# Altium project SSDI.PrjPCB
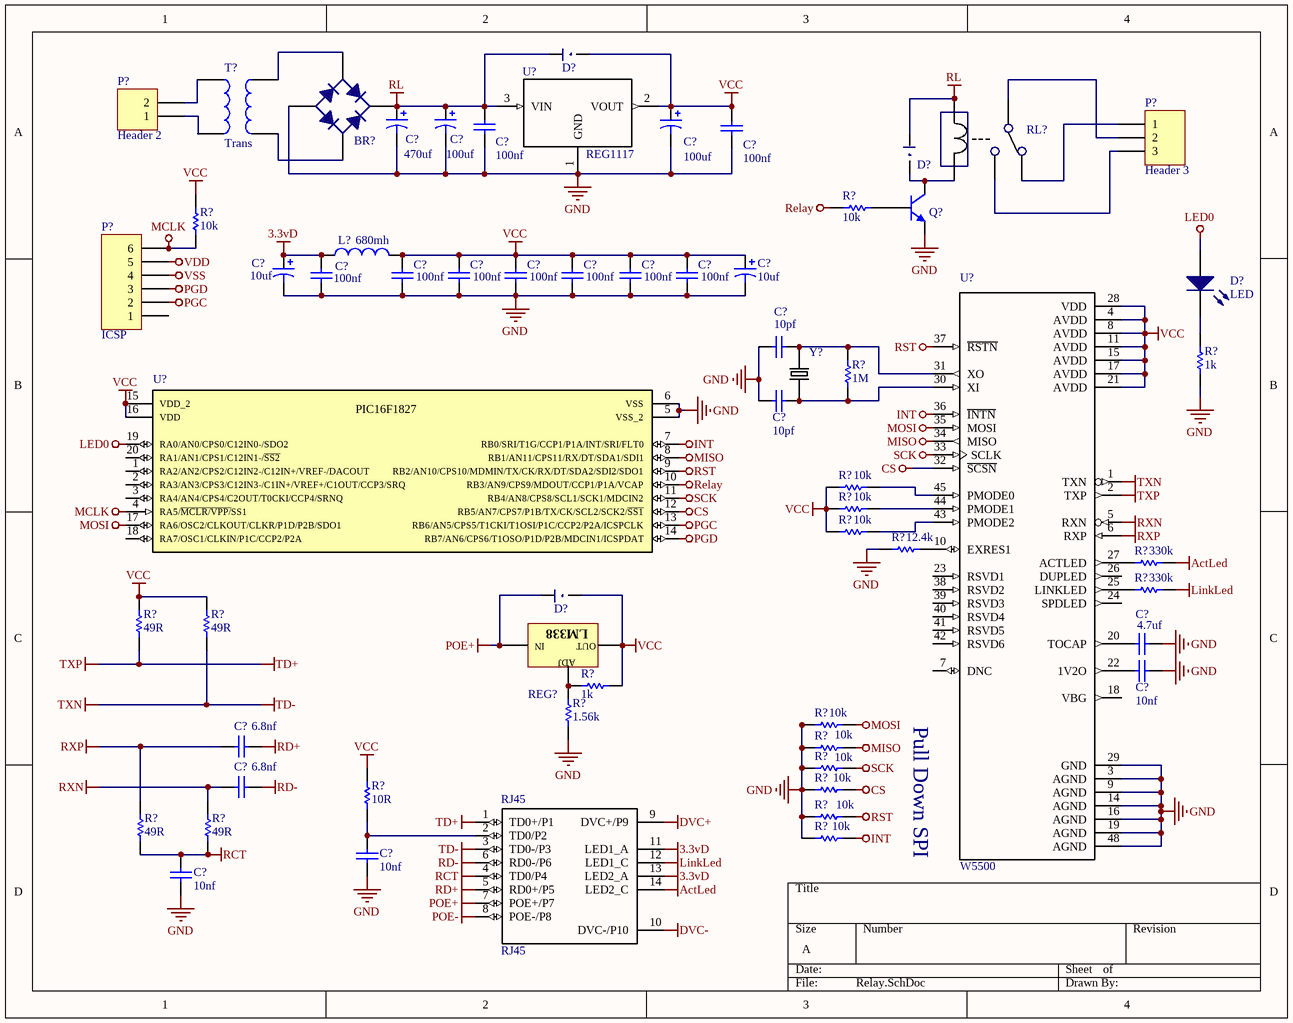
[diagram p0: Relay.SchDoc]
4 sheets, 235 parts. Net scope: global (net labels, ports and power ports of the same name join across sheets).
Sheets:
  Relay.SchDoc
  Switch.SchDoc
  Keypad.SchDoc
  Motor_SBS.SchDoc

## Sheet Relay.SchDoc
size A

### Parts
(Parts that share a designator on the sheet are numbered #1, #2 ... from top to bottom, then left to right.)
BR?#1  Puente Diodo Rectificador  [Bridge Rectifier 1]  (value not drawn)
C?#1  470uf  [Electrolytic Capacitor 1000uF 50V]
C?#2  100uf  [Electrolytic Capacitor 100uf-220uf 50V]
C?#3  100nf  [1206CAP]
C?#4  100uf  [Electrolytic Capacitor S]
C?#5  100nf  [1206CAP]
C?#6  10uf  [Electrolytic Capacitor S]
C?#7  100nf  [1206CAP]
C?#8  100nf  [1206CAP]
C?#9  100nf  [1206CAP]
C?#10  100nf  [1206CAP]
C?#11  100nf  [1206CAP]
C?#12  100nf  [1206CAP]
C?#13  100nf  [1206CAP]
C?#14  10uf  [Electrolytic Capacitor S]
C?#15  10pf  [1206CAP]
C?#16  10pf  [1206CAP]
C?#17  4.7uf  [1206CAP]
C?#18  10nf  [1206CAP]
C?#19  6.8nf  [1206CAP]
C?#20  6.8nf  [1206CAP]
C?#21  10nf  [1206CAP]
C?#22  10nf  [1206CAP]
D?#1  Diodo  [1206DIODE]  (value not drawn)
D?#2  Diodo  [1206DIODE]  (value not drawn)
D?#3  LED  [1206DIODE]
D?#4  Diodo  [1206DIODE]  (value not drawn)
L?#1  value 680mh  [Resistor 1/2 W]  (hidden comment: Inductor)
P?#1  Header 3  [HDR1X3]
P?#2  Header 2  [HDR1X2]
P?#3  ICSP  [HDR1X6]
Q?  Transistor NPN  [SOT-232N3904NPN]  (value not drawn)
R?#1  10k  [1206RES]
R?#2  10k  [1206RES]
R?#3  1k  [1206RES]
R?#4  1M  [1206RES]
R?#5  10k  [1206RES]
R?#6  10k  [1206RES]
R?#7  10k  [1206RES]
R?#8  12.4k  [1206RES]
R?#9  330k  [1206RES]
R?#10  330k  [1206RES]
R?#11  49R  [1206RES]
R?#12  49R  [1206RES]
R?#13  1k  [1206RES]
R?#14  1.56k  [1206RES]
R?#15  10k  [1206RES]
R?#16  10k  [1206RES]
R?#17  10k  [1206RES]
R?#18  10k  [1206RES]
R?#19  10R  [1206RES]
R?#20  10k  [1206RES]
R?#21  49R  [1206RES]
R?#22  49R  [1206RES]
R?#23  10k  [1206RES]
REG?#1  LM338  [TO-220]  (value not drawn)
RJ45#1  RJ45  [RJ45]
RL?  Relay SPDT  [SPDT Relay]  (value not drawn)
T?#1  Trans  [TRANS]
U?#1  REG1117  [SOT223]
U?#2  W5500  [QFP50P900X900X160-48N]
U?#3  PIC16F1827-I/SS  [SSOP-20]  (value not drawn)
Y?#1  E  [XTAL]  (value not drawn)

### Nets
3.3vD: C?#6.1 C?#7.2 L?#1.1 RJ45#1.11(LED1_A) RJ45#1.13(LED2_A)
ActLed: R?#9.2 RJ45#1.14(LED2_C)
CS: R?#18.2 U?#2.32(~{SCSN}) U?#3.12(RB5/AN7/CPS7/P1B/TX/CK/SCL2/SCK2/~{SS1})
DVC+: RJ45#1.9(DVC+/P9)
DVC-: RJ45#1.10(DVC-/P10)
GND: BR?#1.3(A) C?#1.2 C?#2.2 C?#3.1 C?#4.2 C?#5.1 C?#6.2 C?#7.1 C?#8.1 C?#9.1 C?#10.1 C?#11.1 C?#12.1 C?#13.1 C?#14.2 C?#15.1 C?#16.1 C?#17.2 C?#18.2 C?#21.2 C?#22.2 Q?.1(E) R?#3.2 R?#8.1 R?#14.1 R?#15.1 R?#16.1 R?#17.1 R?#18.1 R?#20.1 R?#23.1 U?#1.1(GND) U?#2.3(AGND) U?#2.9(AGND) U?#2.14(AGND) U?#2.16(AGND) U?#2.19(AGND) U?#2.29(GND) U?#2.48(AGND) U?#3.5(VSS_2) U?#3.6(VSS)
INT: R?#23.2 U?#2.36(~{INTN}) U?#3.7(RB0/SRI/T1G/CCP1/P1A/INT/SRI/FLT0)
LED0: D?#3.1(A) U?#3.19(RA0/AN0/CPS0/C12IN0-/SDO2)
LinkLed: R?#10.2 RJ45#1.12(LED1_C)
MCLK: P?#3.6 R?#2.1 U?#3.4(RA5/~{MCLR/VPP/}SS1)
MISO: R?#16.2 U?#2.34(MISO) U?#3.8(RB1/AN11/CPS11/RX/DT/SDA1/SDI1)
MOSI: R?#15.2 U?#2.35(MOSI) U?#3.17(RA6/OSC2/CLKOUT/CLKR/P1D/P2B/SDO1)
PGC: P?#3.2 U?#3.13(RB6/AN5/CPS5/T1CKI/T1OSI/P1C/CCP2/P2A/ICSPCLK)
PGD: P?#3.3 U?#3.14(RB7/AN6/CPS6/T1OSO/P1D/P2B/MDCIN1/ICSPDAT)
POE+: D?#4.2 REG?#1.3 RJ45#1.7(POE+/P7)
POE-: RJ45#1.8(POE-/P8)
RCT: C?#22.1 R?#21.2 R?#22.2 RJ45#1.4(TD0/P4)
RD+: C?#19.1 RJ45#1.5(RD0+/P5)
RD-: C?#20.1 RJ45#1.6(RD0-/P6)
Relay: R?#1.2 U?#3.10(RB3/AN9/CPS9/MDOUT/CCP1/P1A/VCAP)
RL: BR?#1.1(K) C?#1.1 C?#2.1 C?#3.2 D?#1.2 D?#2.2 RL?.1 U?#1.3(VIN)
RST: R?#20.2 U?#2.37(~{RSTN}) U?#3.9(RB2/AN10/CPS10/MDMIN/TX/CK/RX/DT/SDA2/SDI2/SDO1)
RXN: C?#20.2 R?#22.1 U?#2.5(RXN)
RXP: C?#19.2 R?#21.1 U?#2.6(RXP)
SCK: R?#17.2 U?#2.33(SCLK) U?#3.11(RB4/AN8/CPS8/SCL1/SCK1/MDCIN2)
TD+: R?#11.2 RJ45#1.1(TD0+/P1) U?#2.2(TXP)  [also labelled TXP]
TD-: R?#12.2 RJ45#1.3(TD0-/P3) U?#2.1(TXN)  [also labelled TXN]
VCC: C?#4.1 C?#5.2 C?#8.2 C?#9.2 C?#10.2 C?#11.2 C?#12.2 C?#13.2 C?#14.1 D?#1.1 D?#4.1 L?#1.2 R?#2.2 R?#5.1 R?#6.1 R?#7.1 R?#11.1 R?#12.1 R?#13.2 R?#19.1 REG?#1.2 U?#1.2(VOUT) U?#2.4(AVDD) U?#2.8(AVDD) U?#2.11(AVDD) U?#2.15(AVDD) U?#2.17(AVDD) U?#2.21(AVDD) U?#2.28(VDD) U?#3.15(VDD_2) U?#3.16(VDD)
VDD: P?#3.5
VSS: P?#3.4
NetBR?#1_2: BR?#1.2(C) T?#1.3
NetBR?#1_4: BR?#1.4(C) T?#1.4
NetC?#15_2: C?#15.2 R?#4.2 U?#2.31(XO) Y?#1.1
NetC?#16_2: C?#16.2 R?#4.1 U?#2.30(XI) Y?#1.2
NetC?#17_1: C?#17.1 U?#2.20(TOCAP)
NetC?#18_1: C?#18.1 U?#2.22(1V2O)
NetC?#21_1: C?#21.1 R?#19.2 RJ45#1.2(TD0/P2)
NetD?#2_1: D?#2.1 Q?.3(C) RL?.2
NetD?#3_2: D?#3.2(K) R?#3.1
NetP?#1_1: P?#1.1 RL?.5
NetP?#1_2: P?#1.2 RL?.3
NetP?#1_3: P?#1.3 RL?.4
NetP?#2_1: P?#2.1 T?#1.2
NetP?#2_2: P?#2.2 T?#1.1
NetQ?_2: Q?.2(B) R?#1.1
NetR?#5_2: R?#5.2 U?#2.45(PMODE0)
NetR?#6_2: R?#6.2 U?#2.44(PMODE1)
NetR?#7_2: R?#7.2 U?#2.43(PMODE2)
NetR?#8_2: R?#8.2 U?#2.10(EXRES1)
NetR?#9_1: R?#9.1 U?#2.27(ACTLED)
NetR?#10_1: R?#10.1 U?#2.25(LINKLED)
NetR?#13_1: R?#13.1 R?#14.2 REG?#1.1

Not connected (* = marked no-connect by the designer): P?#3 1; U?#2 7(DNC) 18(VBG) 23(RSVD1) 24(SPDLED) 26(DUPLED) 38(RSVD2) 39(RSVD3) 40(RSVD4) 41(RSVD5) 42(RSVD6); U?#3 1(RA2/AN2/CPS2/C12IN2-/C12IN+/VREF-/DACOUT) 2(RA3/AN3/CPS3/C12IN3-/C1IN+/VREF+/C1OUT/CCP3/SRQ) 3(RA4/AN4/CPS4/C2OUT/T0CKI/CCP4/SRNQ) 18(RA7/OSC1/CLKIN/P1C/CCP2/P2A) 20(RA1/AN1/CPS1/C12IN1-/~{SS2})

### Notes on the sheet
- (near U?#2) Pull Down SPI
- (in symbol LM338) IN; OUT; ADJ
- (in symbol PIC16F1827-I/SS) PIC16F1827

### Library data of the parts
C?#1 C?#2 C?#4 C?#6 C?#14 = Capacitor Electrolitico
C?#3 C?#5 C?#7-C?#13 C?#15-C?#22 = Capacitor de paso
D?#3 = LED: Typical LED; Published: 8-Jun-2000; LatestRevisionDate: 17-Jul-2002; LatestRevisionNote: Re-released for DXP Platform.; PackageVersion: Feb-2002; PackageReference: 3.2X1.6X1.1; Publisher: Altium Limited
L?#1 = Inductor: Code_IEC: 1005; Published: 8-Jun-2000; LatestRevisionDate: 29-May-2009; LatestRevisionNote: IPC-7351 Footprint Added.; PackageReference: 0402-A; Publisher: Altium Limited; PackageDescription: Chip Inductor; Code_JEITA: 0402
P?#1 = Header 3: Header, 3-Pin; LatestRevisionDate: 17-Jul-2002; LatestRevisionNote: Re-released for DXP Platform.; Publisher: Altium Limited
P?#2 = Header 2: Header, 2-Pin; LatestRevisionDate: 17-Jul-2002; LatestRevisionNote: Re-released for DXP Platform.; Publisher: Altium Limited
P?#3 = Header 6: Header, 6-Pin; LatestRevisionDate: 17-Jul-2002; LatestRevisionNote: Re-released for DXP Platform.; Publisher: Altium Limited
R?#1-R?#23 = Resistor
REG?#1 = LM338: Variable Voltage Regulator
RJ45#1 = RJ45Poe
T?#1 = Trans: Transformer; Published: 24-Mar-1999; LatestRevisionDate: 08-Jul-2005; LatestRevisionNote: Mech Layer 1 removed.; PackageReference: TRANS; Publisher: Altium Limited; PackageDescription: Transformer; 4 Leads
U?#1 = REG1117: LDO Regulator Pos 1.25V to 13.5V 0.8A 4-Pin_3+Tab_ SOT-223 Tube; MF: Texas Instruments; Digi-Key_Purchase_URL: https://www.digikey.com/product-detail/en/texas-instruments/REG1117/REG1117-ND/251211?utm_source=snapeda&utm_medium=aggregator&utm_campaign=symbol; MP: REG1117; Package: SOT-223-4 Texas Instruments; Digi-Key_Part_Number: REG1117-ND; SnapEDA_Link: https://www.snapeda.com/parts/REG1117/Texas%20Instruments/view-part/?ref=snap; Value: *
U?#2 = W5500: Victor Pure White Collection Wood Tidy Tower Organizer; MF: WIZnet; Package: LQFP-48 Victor Technologies; Price: None; Availability: Unavailable; MP: W5500; SnapEDA_Link: https://www.snapeda.com/parts/W5500/WIZnet/view-part/?ref=snap; Value: *
U?#3 = PIC16F1827-I/SS: PIC12 Series 384 B RAM 7 kB Flash 80 MHz 8-Bit Microcontroller SMT - SSOP-20; MF: Microchip; MP: PIC16F1827-I/SS; Digi-Key_Purchase_URL: https://www.digikey.do/product-detail/en/microchip-technology/PIC16F1827-I-SS/PIC16F1827-I-SS-ND/2201967?utm_source=snapeda&utm_medium=aggregator&utm_campaign=symbol; Package: SSOP-20 Microchip; SnapEDA_Link: https://www.snapeda.com/parts/PIC16F1827-I/SS/Microchip/view-part/?ref=snap; Digi-Key_Part_Number: PIC16F1827-I/SS-ND; Value: *
Y?#1 = ECS-160-20-20A-TR: Semi-Frequency Controls-Surface Mount Crystals; MF: ECS Inc.; MP: ECS-160-20-20A-TR; Package: SMD-2 ECS International; Availability: Unavailable; Price: None; SnapEDA_Link: https://www.snapeda.com/parts/ECS-160-20-20A-TR/ECS%20Inc./view-part/?ref=snap; Value: *

## Sheet Switch.SchDoc
size A
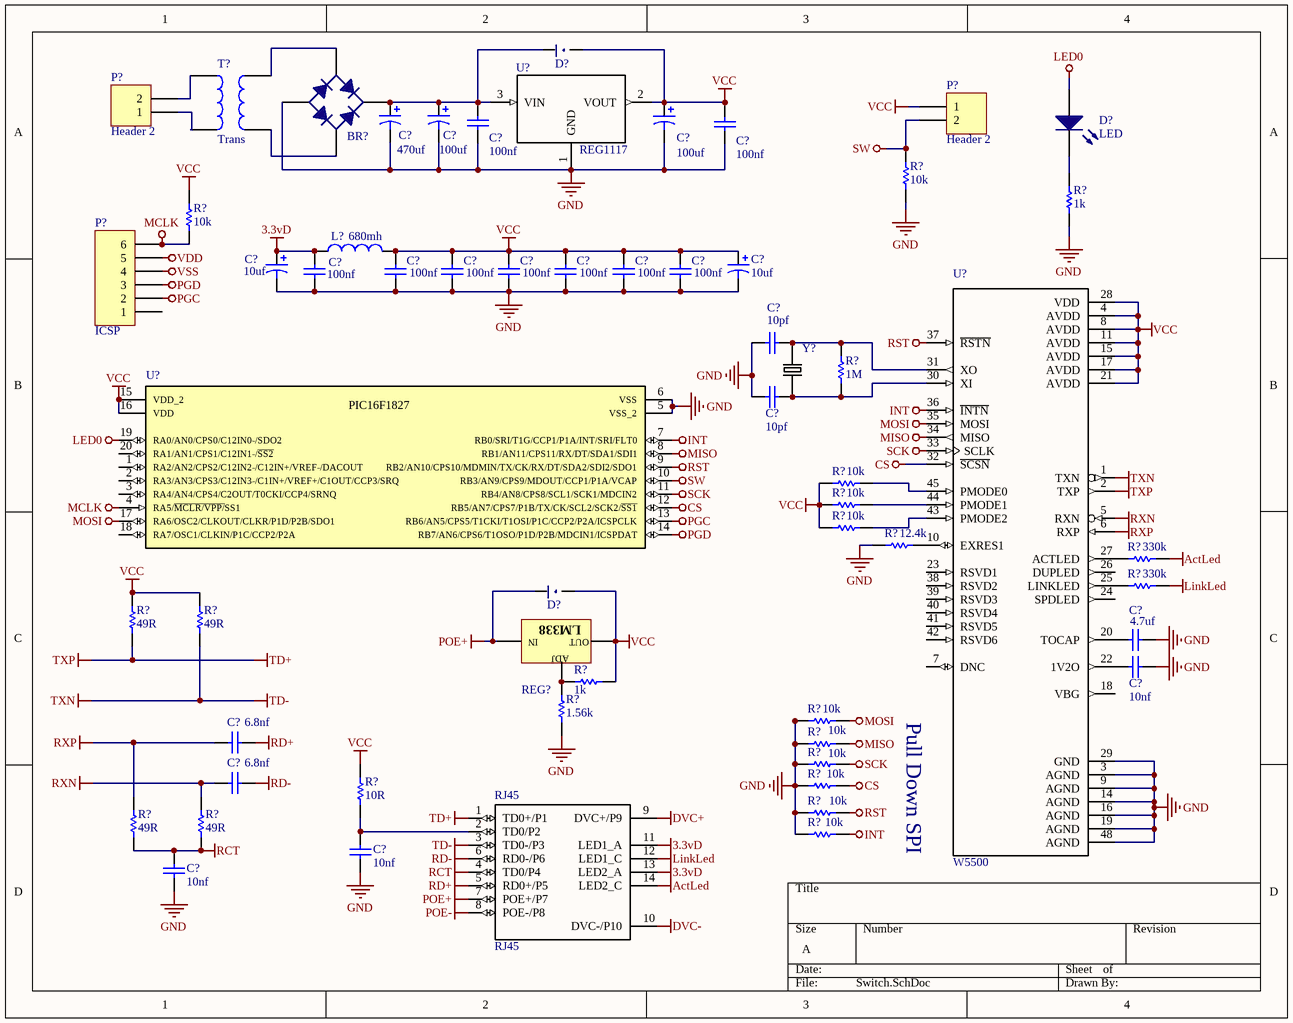
[diagram p1: Switch.SchDoc]

### Parts
(Parts that share a designator on the sheet are numbered #1, #2 ... from top to bottom, then left to right.)
BR?#2  Puente Diodo Rectificador  [Bridge Rectifier 1]  (value not drawn)
C?#23  470uf  [Electrolytic Capacitor 1000uF 50V]
C?#24  100uf  [Electrolytic Capacitor 100uf-220uf 50V]
C?#25  100nf  [1206CAP]
C?#26  100uf  [Electrolytic Capacitor S]
C?#27  100nf  [1206CAP]
C?#28  10uf  [Electrolytic Capacitor S]
C?#29  100nf  [1206CAP]
C?#30  100nf  [1206CAP]
C?#31  100nf  [1206CAP]
C?#32  100nf  [1206CAP]
C?#33  100nf  [1206CAP]
C?#34  100nf  [1206CAP]
C?#35  100nf  [1206CAP]
C?#36  10uf  [Electrolytic Capacitor S]
C?#37  10pf  [1206CAP]
C?#38  10pf  [1206CAP]
C?#39  4.7uf  [1206CAP]
C?#40  10nf  [1206CAP]
C?#41  6.8nf  [1206CAP]
C?#42  6.8nf  [1206CAP]
C?#43  10nf  [1206CAP]
C?#44  10nf  [1206CAP]
D?#5  Diodo  [1206DIODE]  (value not drawn)
D?#6  LED  [1206DIODE]
D?#7  Diodo  [1206DIODE]  (value not drawn)
L?#2  value 680mh  [Resistor 1/2 W]  (hidden comment: Inductor)
P?#4  Header 2  [HDR1X2]
P?#5  Header 2  [HDR1X2]
P?#6  ICSP  [HDR1X6]
R?#24  10k  [1206RES]
R?#25  1k  [1206RES]
R?#26  10k  [1206RES]
R?#27  1M  [1206RES]
R?#28  10k  [1206RES]
R?#29  10k  [1206RES]
R?#30  10k  [1206RES]
R?#31  12.4k  [1206RES]
R?#32  330k  [1206RES]
R?#33  330k  [1206RES]
R?#34  49R  [1206RES]
R?#35  49R  [1206RES]
R?#36  1k  [1206RES]
R?#37  1.56k  [1206RES]
R?#38  10k  [1206RES]
R?#39  10k  [1206RES]
R?#40  10k  [1206RES]
R?#41  10R  [1206RES]
R?#42  10k  [1206RES]
R?#43  10k  [1206RES]
R?#44  49R  [1206RES]
R?#45  49R  [1206RES]
R?#46  10k  [1206RES]
REG?#2  LM338  [TO-220]  (value not drawn)
RJ45#2  RJ45  [RJ45]
T?#2  Trans  [TRANS]
U?#4  REG1117  [SOT223]
U?#5  W5500  [QFP50P900X900X160-48N]
U?#6  PIC16F1827-I/SS  [SSOP-20]  (value not drawn)
Y?#2  E  [XTAL]  (value not drawn)

### Nets
3.3vD: C?#28.1 C?#29.2 L?#2.1 RJ45#2.11(LED1_A) RJ45#2.13(LED2_A)
ActLed: R?#32.2 RJ45#2.14(LED2_C)
CS: R?#42.2 U?#5.32(~{SCSN}) U?#6.12(RB5/AN7/CPS7/P1B/TX/CK/SCL2/SCK2/~{SS1})
DVC+: RJ45#2.9(DVC+/P9)
DVC-: RJ45#2.10(DVC-/P10)
GND: BR?#2.3(A) C?#23.2 C?#24.2 C?#25.1 C?#26.2 C?#27.1 C?#28.2 C?#29.1 C?#30.1 C?#31.1 C?#32.1 C?#33.1 C?#34.1 C?#35.1 C?#36.2 C?#37.1 C?#38.1 C?#39.2 C?#40.2 C?#43.2 C?#44.2 R?#24.2 R?#25.2 R?#31.1 R?#37.1 R?#38.1 R?#39.1 R?#40.1 R?#42.1 R?#43.1 R?#46.1 U?#4.1(GND) U?#5.3(AGND) U?#5.9(AGND) U?#5.14(AGND) U?#5.16(AGND) U?#5.19(AGND) U?#5.29(GND) U?#5.48(AGND) U?#6.5(VSS_2) U?#6.6(VSS)
INT: R?#46.2 U?#5.36(~{INTN}) U?#6.7(RB0/SRI/T1G/CCP1/P1A/INT/SRI/FLT0)
LED0: D?#6.1(A) U?#6.19(RA0/AN0/CPS0/C12IN0-/SDO2)
LinkLed: R?#33.2 RJ45#2.12(LED1_C)
MCLK: P?#6.6 R?#26.1 U?#6.4(RA5/~{MCLR/VPP/}SS1)
MISO: R?#39.2 U?#5.34(MISO) U?#6.8(RB1/AN11/CPS11/RX/DT/SDA1/SDI1)
MOSI: R?#38.2 U?#5.35(MOSI) U?#6.17(RA6/OSC2/CLKOUT/CLKR/P1D/P2B/SDO1)
PGC: P?#6.2 U?#6.13(RB6/AN5/CPS5/T1CKI/T1OSI/P1C/CCP2/P2A/ICSPCLK)
PGD: P?#6.3 U?#6.14(RB7/AN6/CPS6/T1OSO/P1D/P2B/MDCIN1/ICSPDAT)
POE+: D?#7.2 REG?#2.3 RJ45#2.7(POE+/P7)
POE-: RJ45#2.8(POE-/P8)
RCT: C?#44.1 R?#44.2 R?#45.2 RJ45#2.4(TD0/P4)
RD+: C?#41.1 RJ45#2.5(RD0+/P5)
RD-: C?#42.1 RJ45#2.6(RD0-/P6)
RST: R?#43.2 U?#5.37(~{RSTN}) U?#6.9(RB2/AN10/CPS10/MDMIN/TX/CK/RX/DT/SDA2/SDI2/SDO1)
RXN: C?#42.2 R?#45.1 U?#5.5(RXN)
RXP: C?#41.2 R?#44.1 U?#5.6(RXP)
SCK: R?#40.2 U?#5.33(SCLK) U?#6.11(RB4/AN8/CPS8/SCL1/SCK1/MDCIN2)
SW: P?#4.2 R?#24.1 U?#6.10(RB3/AN9/CPS9/MDOUT/CCP1/P1A/VCAP)
TD+: R?#34.2 RJ45#2.1(TD0+/P1) U?#5.2(TXP)  [also labelled TXP]
TD-: R?#35.2 RJ45#2.3(TD0-/P3) U?#5.1(TXN)  [also labelled TXN]
VCC: C?#26.1 C?#27.2 C?#30.2 C?#31.2 C?#32.2 C?#33.2 C?#34.2 C?#35.2 C?#36.1 D?#5.1 D?#7.1 L?#2.2 P?#4.1 R?#26.2 R?#28.1 R?#29.1 R?#30.1 R?#34.1 R?#35.1 R?#36.2 R?#41.1 REG?#2.2 U?#4.2(VOUT) U?#5.4(AVDD) U?#5.8(AVDD) U?#5.11(AVDD) U?#5.15(AVDD) U?#5.17(AVDD) U?#5.21(AVDD) U?#5.28(VDD) U?#6.15(VDD_2) U?#6.16(VDD)
VDD: P?#6.5
VSS: P?#6.4
NetBR?#2_1: BR?#2.1(K) C?#23.1 C?#24.1 C?#25.2 D?#5.2 U?#4.3(VIN)
NetBR?#2_2: BR?#2.2(C) T?#2.3
NetBR?#2_4: BR?#2.4(C) T?#2.4
NetC?#37_2: C?#37.2 R?#27.2 U?#5.31(XO) Y?#2.1
NetC?#38_2: C?#38.2 R?#27.1 U?#5.30(XI) Y?#2.2
NetC?#39_1: C?#39.1 U?#5.20(TOCAP)
NetC?#40_1: C?#40.1 U?#5.22(1V2O)
NetC?#43_1: C?#43.1 R?#41.2 RJ45#2.2(TD0/P2)
NetD?#6_2: D?#6.2(K) R?#25.1
NetP?#5_1: P?#5.1 T?#2.2
NetP?#5_2: P?#5.2 T?#2.1
NetR?#28_2: R?#28.2 U?#5.45(PMODE0)
NetR?#29_2: R?#29.2 U?#5.44(PMODE1)
NetR?#30_2: R?#30.2 U?#5.43(PMODE2)
NetR?#31_2: R?#31.2 U?#5.10(EXRES1)
NetR?#32_1: R?#32.1 U?#5.27(ACTLED)
NetR?#33_1: R?#33.1 U?#5.25(LINKLED)
NetR?#36_1: R?#36.1 R?#37.2 REG?#2.1

Not connected (* = marked no-connect by the designer): P?#6 1; U?#5 7(DNC) 18(VBG) 23(RSVD1) 24(SPDLED) 26(DUPLED) 38(RSVD2) 39(RSVD3) 40(RSVD4) 41(RSVD5) 42(RSVD6); U?#6 1(RA2/AN2/CPS2/C12IN2-/C12IN+/VREF-/DACOUT) 2(RA3/AN3/CPS3/C12IN3-/C1IN+/VREF+/C1OUT/CCP3/SRQ) 3(RA4/AN4/CPS4/C2OUT/T0CKI/CCP4/SRNQ) 18(RA7/OSC1/CLKIN/P1C/CCP2/P2A) 20(RA1/AN1/CPS1/C12IN1-/~{SS2})

### Notes on the sheet
- (near U?#5) Pull Down SPI
- (in symbol LM338) IN; OUT; ADJ
- (in symbol PIC16F1827-I/SS) PIC16F1827

### Library data of the parts
C?#23 C?#24 C?#26 C?#28 C?#36 = Capacitor Electrolitico
C?#25 C?#27 C?#29-C?#35 C?#37-C?#44 = Capacitor de paso
D?#6 = LED: Typical LED; Published: 8-Jun-2000; LatestRevisionDate: 17-Jul-2002; LatestRevisionNote: Re-released for DXP Platform.; PackageVersion: Feb-2002; PackageReference: 3.2X1.6X1.1; Publisher: Altium Limited
L?#2 = Inductor: Code_IEC: 1005; Published: 8-Jun-2000; LatestRevisionDate: 29-May-2009; LatestRevisionNote: IPC-7351 Footprint Added.; PackageReference: 0402-A; Publisher: Altium Limited; PackageDescription: Chip Inductor; Code_JEITA: 0402
P?#4 P?#5 = Header 2: Header, 2-Pin; LatestRevisionDate: 17-Jul-2002; LatestRevisionNote: Re-released for DXP Platform.; Publisher: Altium Limited
P?#6 = Header 6: Header, 6-Pin; LatestRevisionDate: 17-Jul-2002; LatestRevisionNote: Re-released for DXP Platform.; Publisher: Altium Limited
R?#24-R?#46 = Resistor
REG?#2 = LM338: Variable Voltage Regulator
RJ45#2 = RJ45Poe
T?#2 = Trans: Transformer; Published: 24-Mar-1999; LatestRevisionDate: 08-Jul-2005; LatestRevisionNote: Mech Layer 1 removed.; PackageReference: TRANS; Publisher: Altium Limited; PackageDescription: Transformer; 4 Leads
U?#4 = REG1117: as U?#1 on sheet Relay; Digi-Key_Purchase_URL: https://www.digikey.com/product-detail/en/texas-instruments/REG1117/REG1117-ND/251211?utm_source=snapeda&utm_medium=aggregator&utm_campaign=symbol; MP: REG1117; Package: SOT-223-4 Texas Instruments; Digi-Key_Part_Number: REG1117-ND; SnapEDA_Link: https://www.snapeda.com/parts/REG1117/Texas%20Instruments/view-part/?ref=snap; Value: *
U?#5 = W5500: as U?#2 on sheet Relay; Package: LQFP-48 Victor Technologies; Price: None; Availability: Unavailable; MP: W5500; SnapEDA_Link: https://www.snapeda.com/parts/W5500/WIZnet/view-part/?ref=snap; Value: *
U?#6 = PIC16F1827-I/SS: as U?#3 on sheet Relay; MP: PIC16F1827-I/SS; Digi-Key_Purchase_URL: https://www.digikey.do/product-detail/en/microchip-technology/PIC16F1827-I-SS/PIC16F1827-I-SS-ND/2201967?utm_source=snapeda&utm_medium=aggregator&utm_campaign=symbol; Package: SSOP-20 Microchip; SnapEDA_Link: https://www.snapeda.com/parts/PIC16F1827-I/SS/Microchip/view-part/?ref=snap; Digi-Key_Part_Number: PIC16F1827-I/SS-ND; Value: *
Y?#2 = ECS-160-20-20A-TR: as Y?#1 on sheet Relay; MP: ECS-160-20-20A-TR; Package: SMD-2 ECS International; Availability: Unavailable; Price: None; SnapEDA_Link: https://www.snapeda.com/parts/ECS-160-20-20A-TR/ECS%20Inc./view-part/?ref=snap; Value: *

## Sheet Keypad.SchDoc
size A
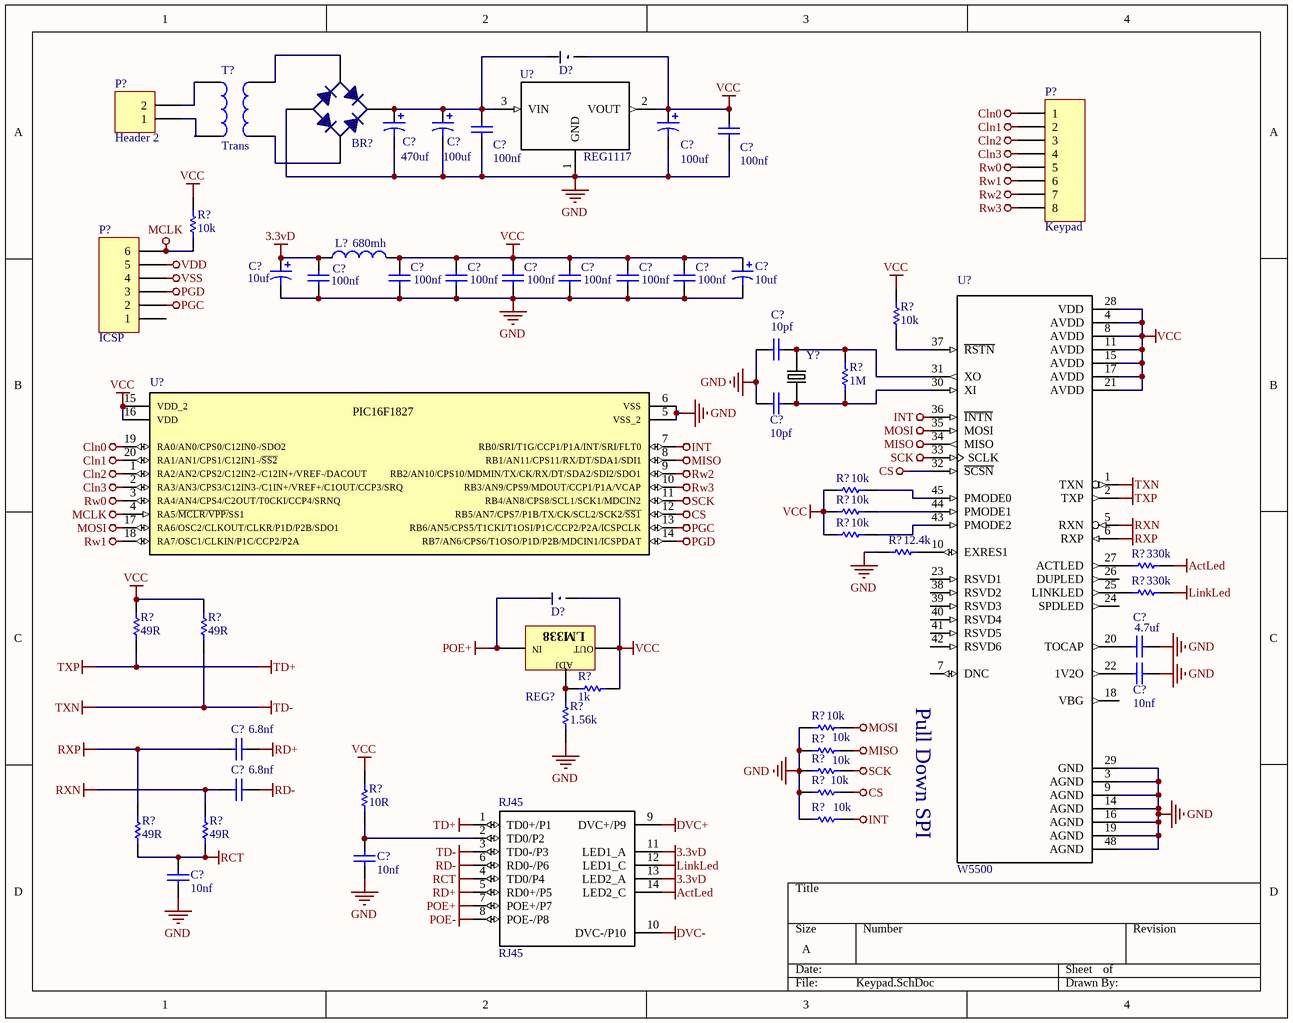
[diagram p2: Keypad.SchDoc]

### Parts
(Parts that share a designator on the sheet are numbered #1, #2 ... from top to bottom, then left to right.)
BR?#3  Puente Diodo Rectificador  [Bridge Rectifier 1]  (value not drawn)
C?#45  470uf  [Electrolytic Capacitor 1000uF 50V]
C?#46  100uf  [Electrolytic Capacitor 100uf-220uf 50V]
C?#47  100nf  [1206CAP]
C?#48  100uf  [Electrolytic Capacitor S]
C?#49  100nf  [1206CAP]
C?#50  10uf  [Electrolytic Capacitor S]
C?#51  100nf  [1206CAP]
C?#52  100nf  [1206CAP]
C?#53  100nf  [1206CAP]
C?#54  100nf  [1206CAP]
C?#55  100nf  [1206CAP]
C?#56  100nf  [1206CAP]
C?#57  100nf  [1206CAP]
C?#58  10uf  [Electrolytic Capacitor S]
C?#59  10pf  [1206CAP]
C?#60  10pf  [1206CAP]
C?#61  4.7uf  [1206CAP]
C?#62  10nf  [1206CAP]
C?#63  6.8nf  [1206CAP]
C?#64  6.8nf  [1206CAP]
C?#65  10nf  [1206CAP]
C?#66  10nf  [1206CAP]
D?#8  Diodo  [1206DIODE]  (value not drawn)
D?#9  Diodo  [1206DIODE]  (value not drawn)
L?#3  value 680mh  [Resistor 1/2 W]  (hidden comment: Inductor)
P?#7  Keypad  [HDR1X8]
P?#8  Header 2  [HDR1X2]
P?#9  ICSP  [HDR1X6]
R?#47  10k  [1206RES]
R?#48  10k  [1206RES]
R?#49  1M  [1206RES]
R?#50  10k  [1206RES]
R?#51  10k  [1206RES]
R?#52  10k  [1206RES]
R?#53  12.4k  [1206RES]
R?#54  330k  [1206RES]
R?#55  330k  [1206RES]
R?#56  49R  [1206RES]
R?#57  49R  [1206RES]
R?#58  1k  [1206RES]
R?#59  1.56k  [1206RES]
R?#60  10k  [1206RES]
R?#61  10k  [1206RES]
R?#62  10k  [1206RES]
R?#63  10R  [1206RES]
R?#64  10k  [1206RES]
R?#65  10k  [1206RES]
R?#66  49R  [1206RES]
R?#67  49R  [1206RES]
REG?#3  LM338  [TO-220]  (value not drawn)
RJ45#3  RJ45  [RJ45]
T?#3  Trans  [TRANS]
U?#7  REG1117  [SOT223]
U?#8  W5500  [QFP50P900X900X160-48N]
U?#9  PIC16F1827-I/SS  [SSOP-20]  (value not drawn)
Y?#3  E  [XTAL]  (value not drawn)

### Nets
3.3vD: C?#50.1 C?#51.2 L?#3.1 RJ45#3.11(LED1_A) RJ45#3.13(LED2_A)
ActLed: R?#54.2 RJ45#3.14(LED2_C)
Cln0: P?#7.1 U?#9.19(RA0/AN0/CPS0/C12IN0-/SDO2)
Cln1: P?#7.2 U?#9.20(RA1/AN1/CPS1/C12IN1-/~{SS2})
Cln2: P?#7.3 U?#9.1(RA2/AN2/CPS2/C12IN2-/C12IN+/VREF-/DACOUT)
Cln3: P?#7.4 U?#9.2(RA3/AN3/CPS3/C12IN3-/C1IN+/VREF+/C1OUT/CCP3/SRQ)
CS: R?#64.2 U?#8.32(~{SCSN}) U?#9.12(RB5/AN7/CPS7/P1B/TX/CK/SCL2/SCK2/~{SS1})
DVC+: RJ45#3.9(DVC+/P9)
DVC-: RJ45#3.10(DVC-/P10)
GND: BR?#3.3(A) C?#45.2 C?#46.2 C?#47.1 C?#48.2 C?#49.1 C?#50.2 C?#51.1 C?#52.1 C?#53.1 C?#54.1 C?#55.1 C?#56.1 C?#57.1 C?#58.2 C?#59.1 C?#60.1 C?#61.2 C?#62.2 C?#65.2 C?#66.2 R?#53.1 R?#59.1 R?#60.1 R?#61.1 R?#62.1 R?#64.1 R?#65.1 U?#7.1(GND) U?#8.3(AGND) U?#8.9(AGND) U?#8.14(AGND) U?#8.16(AGND) U?#8.19(AGND) U?#8.29(GND) U?#8.48(AGND) U?#9.5(VSS_2) U?#9.6(VSS)
INT: R?#65.2 U?#8.36(~{INTN}) U?#9.7(RB0/SRI/T1G/CCP1/P1A/INT/SRI/FLT0)
LinkLed: R?#55.2 RJ45#3.12(LED1_C)
MCLK: P?#9.6 R?#47.1 U?#9.4(RA5/~{MCLR/VPP/}SS1)
MISO: R?#61.2 U?#8.34(MISO) U?#9.8(RB1/AN11/CPS11/RX/DT/SDA1/SDI1)
MOSI: R?#60.2 U?#8.35(MOSI) U?#9.17(RA6/OSC2/CLKOUT/CLKR/P1D/P2B/SDO1)
PGC: P?#9.2 U?#9.13(RB6/AN5/CPS5/T1CKI/T1OSI/P1C/CCP2/P2A/ICSPCLK)
PGD: P?#9.3 U?#9.14(RB7/AN6/CPS6/T1OSO/P1D/P2B/MDCIN1/ICSPDAT)
POE+: D?#9.2 REG?#3.3 RJ45#3.7(POE+/P7)
POE-: RJ45#3.8(POE-/P8)
RCT: C?#66.1 R?#66.2 R?#67.2 RJ45#3.4(TD0/P4)
RD+: C?#63.1 RJ45#3.5(RD0+/P5)
RD-: C?#64.1 RJ45#3.6(RD0-/P6)
Rw0: P?#7.5 U?#9.3(RA4/AN4/CPS4/C2OUT/T0CKI/CCP4/SRNQ)
Rw1: P?#7.6 U?#9.18(RA7/OSC1/CLKIN/P1C/CCP2/P2A)
Rw2: P?#7.7 U?#9.9(RB2/AN10/CPS10/MDMIN/TX/CK/RX/DT/SDA2/SDI2/SDO1)
Rw3: P?#7.8 U?#9.10(RB3/AN9/CPS9/MDOUT/CCP1/P1A/VCAP)
RXN: C?#64.2 R?#67.1 U?#8.5(RXN)
RXP: C?#63.2 R?#66.1 U?#8.6(RXP)
SCK: R?#62.2 U?#8.33(SCLK) U?#9.11(RB4/AN8/CPS8/SCL1/SCK1/MDCIN2)
TD+: R?#56.2 RJ45#3.1(TD0+/P1) U?#8.2(TXP)  [also labelled TXP]
TD-: R?#57.2 RJ45#3.3(TD0-/P3) U?#8.1(TXN)  [also labelled TXN]
VCC: C?#48.1 C?#49.2 C?#52.2 C?#53.2 C?#54.2 C?#55.2 C?#56.2 C?#57.2 C?#58.1 D?#8.1 D?#9.1 L?#3.2 R?#47.2 R?#48.2 R?#50.1 R?#51.1 R?#52.1 R?#56.1 R?#57.1 R?#58.2 R?#63.1 REG?#3.2 U?#7.2(VOUT) U?#8.4(AVDD) U?#8.8(AVDD) U?#8.11(AVDD) U?#8.15(AVDD) U?#8.17(AVDD) U?#8.21(AVDD) U?#8.28(VDD) U?#9.15(VDD_2) U?#9.16(VDD)
VDD: P?#9.5
VSS: P?#9.4
NetBR?#3_1: BR?#3.1(K) C?#45.1 C?#46.1 C?#47.2 D?#8.2 U?#7.3(VIN)
NetBR?#3_2: BR?#3.2(C) T?#3.3
NetBR?#3_4: BR?#3.4(C) T?#3.4
NetC?#59_2: C?#59.2 R?#49.2 U?#8.31(XO) Y?#3.1
NetC?#60_2: C?#60.2 R?#49.1 U?#8.30(XI) Y?#3.2
NetC?#61_1: C?#61.1 U?#8.20(TOCAP)
NetC?#62_1: C?#62.1 U?#8.22(1V2O)
NetC?#65_1: C?#65.1 R?#63.2 RJ45#3.2(TD0/P2)
NetP?#8_1: P?#8.1 T?#3.2
NetP?#8_2: P?#8.2 T?#3.1
NetR?#48_1: R?#48.1 U?#8.37(~{RSTN})
NetR?#50_2: R?#50.2 U?#8.45(PMODE0)
NetR?#51_2: R?#51.2 U?#8.44(PMODE1)
NetR?#52_2: R?#52.2 U?#8.43(PMODE2)
NetR?#53_2: R?#53.2 U?#8.10(EXRES1)
NetR?#54_1: R?#54.1 U?#8.27(ACTLED)
NetR?#55_1: R?#55.1 U?#8.25(LINKLED)
NetR?#58_1: R?#58.1 R?#59.2 REG?#3.1

Not connected (* = marked no-connect by the designer): P?#9 1; U?#8 7(DNC) 18(VBG) 23(RSVD1) 24(SPDLED) 26(DUPLED) 38(RSVD2) 39(RSVD3) 40(RSVD4) 41(RSVD5) 42(RSVD6)

### Notes on the sheet
- (near U?#8) Pull Down SPI
- (in symbol LM338) IN; OUT; ADJ
- (in symbol PIC16F1827-I/SS) PIC16F1827

### Library data of the parts
C?#45 C?#46 C?#48 C?#50 C?#58 = Capacitor Electrolitico
C?#47 C?#49 C?#51-C?#57 C?#59-C?#66 = Capacitor de paso
L?#3 = Inductor: Code_IEC: 1005; Published: 8-Jun-2000; LatestRevisionDate: 29-May-2009; LatestRevisionNote: IPC-7351 Footprint Added.; PackageReference: 0402-A; Publisher: Altium Limited; PackageDescription: Chip Inductor; Code_JEITA: 0402
P?#7 = Header 8: Header, 8-Pin; LatestRevisionDate: 17-Jul-2002; LatestRevisionNote: Re-released for DXP Platform.; Publisher: Altium Limited
P?#8 = Header 2: Header, 2-Pin; LatestRevisionDate: 17-Jul-2002; LatestRevisionNote: Re-released for DXP Platform.; Publisher: Altium Limited
P?#9 = Header 6: Header, 6-Pin; LatestRevisionDate: 17-Jul-2002; LatestRevisionNote: Re-released for DXP Platform.; Publisher: Altium Limited
R?#47-R?#67 = Resistor
REG?#3 = LM338: Variable Voltage Regulator
RJ45#3 = RJ45Poe
T?#3 = Trans: Transformer; Published: 24-Mar-1999; LatestRevisionDate: 08-Jul-2005; LatestRevisionNote: Mech Layer 1 removed.; PackageReference: TRANS; Publisher: Altium Limited; PackageDescription: Transformer; 4 Leads
U?#7 = REG1117: as U?#1 on sheet Relay; Digi-Key_Purchase_URL: https://www.digikey.com/product-detail/en/texas-instruments/REG1117/REG1117-ND/251211?utm_source=snapeda&utm_medium=aggregator&utm_campaign=symbol; MP: REG1117; Package: SOT-223-4 Texas Instruments; Digi-Key_Part_Number: REG1117-ND; SnapEDA_Link: https://www.snapeda.com/parts/REG1117/Texas%20Instruments/view-part/?ref=snap; Value: *
U?#8 = W5500: as U?#2 on sheet Relay; Package: LQFP-48 Victor Technologies; Price: None; Availability: Unavailable; MP: W5500; SnapEDA_Link: https://www.snapeda.com/parts/W5500/WIZnet/view-part/?ref=snap; Value: *
U?#9 = PIC16F1827-I/SS: as U?#3 on sheet Relay; MP: PIC16F1827-I/SS; Digi-Key_Purchase_URL: https://www.digikey.do/product-detail/en/microchip-technology/PIC16F1827-I-SS/PIC16F1827-I-SS-ND/2201967?utm_source=snapeda&utm_medium=aggregator&utm_campaign=symbol; Package: SSOP-20 Microchip; SnapEDA_Link: https://www.snapeda.com/parts/PIC16F1827-I/SS/Microchip/view-part/?ref=snap; Digi-Key_Part_Number: PIC16F1827-I/SS-ND; Value: *
Y?#3 = ECS-160-20-20A-TR: as Y?#1 on sheet Relay; MP: ECS-160-20-20A-TR; Package: SMD-2 ECS International; Availability: Unavailable; Price: None; SnapEDA_Link: https://www.snapeda.com/parts/ECS-160-20-20A-TR/ECS%20Inc./view-part/?ref=snap; Value: *

## Sheet Motor_SBS.SchDoc
size A
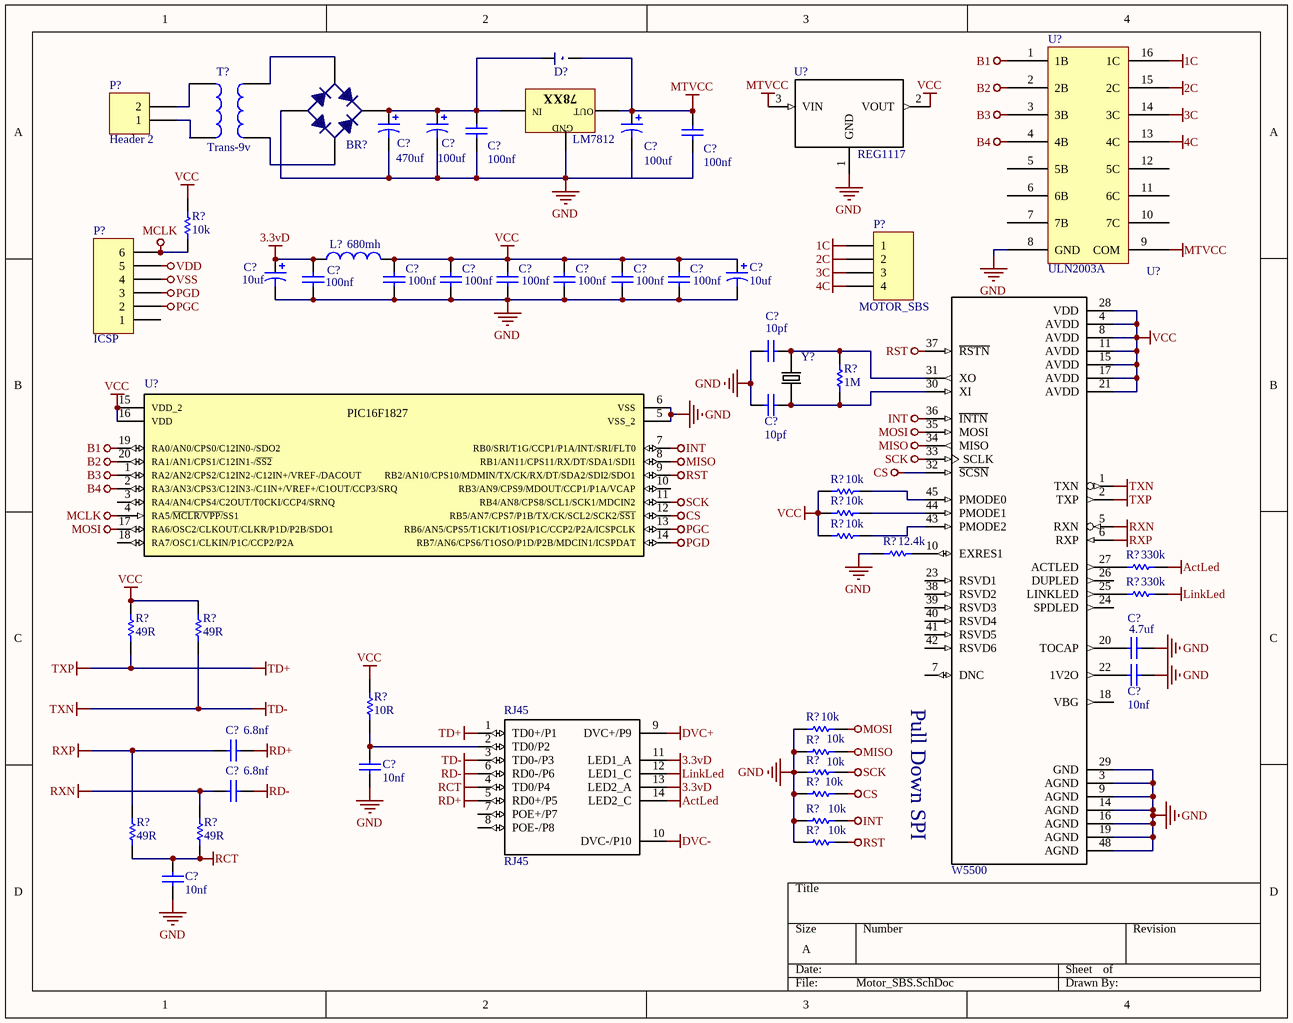
[diagram p3: Motor_SBS.SchDoc]

### Parts
(Parts that share a designator on the sheet are numbered #1, #2 ... from top to bottom, then left to right.)
BR?#4  Puente Diodo Rectificador  [Bridge Rectifier 1]  (value not drawn)
C?#67  470uf  [Electrolytic Capacitor 1000uF 50V]
C?#68  100uf  [Electrolytic Capacitor 100uf-220uf 50V]
C?#69  100nf  [1206CAP]
C?#70  100uf  [Electrolytic Capacitor S]
C?#71  100nf  [1206CAP]
C?#72  10uf  [Electrolytic Capacitor S]
C?#73  100nf  [1206CAP]
C?#74  100nf  [1206CAP]
C?#75  100nf  [1206CAP]
C?#76  100nf  [1206CAP]
C?#77  100nf  [1206CAP]
C?#78  100nf  [1206CAP]
C?#79  100nf  [1206CAP]
C?#80  10uf  [Electrolytic Capacitor S]
C?#81  10pf  [1206CAP]
C?#82  10pf  [1206CAP]
C?#83  4.7uf  [1206CAP]
C?#84  10nf  [1206CAP]
C?#85  6.8nf  [1206CAP]
C?#86  10nf  [1206CAP]
C?#87  6.8nf  [1206CAP]
C?#88  10nf  [1206CAP]
D?#10  Diodo  [1206DIODE]  (value not drawn)
L?#4  value 680mh  [Resistor 1/2 W]  (hidden comment: Inductor)
LM7812  Regulador 78XX  [TO-220]  (value not drawn)
P?#10  Header 2  [HDR1X2]
P?#11  MOTOR_SBS  [HDR1X4]
P?#12  ICSP  [HDR1X6]
R?#68  10k  [1206RES]
R?#69  1M  [1206RES]
R?#70  10k  [1206RES]
R?#71  10k  [1206RES]
R?#72  10k  [1206RES]
R?#73  12.4k  [1206RES]
R?#74  330k  [1206RES]
R?#75  330k  [1206RES]
R?#76  49R  [1206RES]
R?#77  49R  [1206RES]
R?#78  10R  [1206RES]
R?#79  10k  [1206RES]
R?#80  10k  [1206RES]
R?#81  10k  [1206RES]
R?#82  10k  [1206RES]
R?#83  10k  [1206RES]
R?#84  49R  [1206RES]
R?#85  49R  [1206RES]
R?#86  10k  [1206RES]
RJ45#4  RJ45  [RJ45]
T?#4  Trans-9v  [TRANS]
U?#10  REG1117  [SOT223]
U?#11  ULN2003A  [SOP-16]
U?#12  W5500  [QFP50P900X900X160-48N]
U?#13  PIC16F1827-I/SS  [SSOP-20]  (value not drawn)
Y?#4  E  [XTAL]  (value not drawn)

### Nets
1C: P?#11.1 U?#11.16(1C)
2C: P?#11.2 U?#11.15(2C)
3.3vD: C?#72.1 C?#73.2 L?#4.1 RJ45#4.11(LED1_A) RJ45#4.13(LED2_A)
3C: P?#11.3 U?#11.14(3C)
4C: P?#11.4 U?#11.13(4C)
ActLed: R?#74.2 RJ45#4.14(LED2_C)
B1: U?#11.1(1B) U?#13.19(RA0/AN0/CPS0/C12IN0-/SDO2)
B2: U?#11.2(2B) U?#13.20(RA1/AN1/CPS1/C12IN1-/~{SS2})
B3: U?#11.3(3B) U?#13.1(RA2/AN2/CPS2/C12IN2-/C12IN+/VREF-/DACOUT)
B4: U?#11.4(4B) U?#13.2(RA3/AN3/CPS3/C12IN3-/C1IN+/VREF+/C1OUT/CCP3/SRQ)
CS: R?#82.2 U?#12.32(~{SCSN}) U?#13.12(RB5/AN7/CPS7/P1B/TX/CK/SCL2/SCK2/~{SS1})
DVC+: RJ45#4.9(DVC+/P9)
DVC-: RJ45#4.10(DVC-/P10)
GND: BR?#4.3(A) C?#67.2 C?#68.2 C?#69.1 C?#70.2 C?#71.1 C?#72.2 C?#73.1 C?#74.1 C?#75.1 C?#76.1 C?#77.1 C?#78.1 C?#79.1 C?#80.2 C?#81.1 C?#82.1 C?#83.2 C?#84.2 C?#86.2 C?#88.2 LM7812.2 R?#73.1 R?#79.1 R?#80.1 R?#81.1 R?#82.1 R?#83.1 R?#86.1 U?#10.1(GND) U?#11.8(GND) U?#12.3(AGND) U?#12.9(AGND) U?#12.14(AGND) U?#12.16(AGND) U?#12.19(AGND) U?#12.29(GND) U?#12.48(AGND) U?#13.5(VSS_2) U?#13.6(VSS)
INT: R?#83.2 U?#12.36(~{INTN}) U?#13.7(RB0/SRI/T1G/CCP1/P1A/INT/SRI/FLT0)
LinkLed: R?#75.2 RJ45#4.12(LED1_C)
MCLK: P?#12.6 R?#68.1 U?#13.4(RA5/~{MCLR/VPP/}SS1)
MISO: R?#80.2 U?#12.34(MISO) U?#13.8(RB1/AN11/CPS11/RX/DT/SDA1/SDI1)
MOSI: R?#79.2 U?#12.35(MOSI) U?#13.17(RA6/OSC2/CLKOUT/CLKR/P1D/P2B/SDO1)
MTVCC: C?#70.1 C?#71.2 D?#10.1 LM7812.3 U?#10.3(VIN) U?#11.9(COM)
PGC: P?#12.2 U?#13.13(RB6/AN5/CPS5/T1CKI/T1OSI/P1C/CCP2/P2A/ICSPCLK)
PGD: P?#12.3 U?#13.14(RB7/AN6/CPS6/T1OSO/P1D/P2B/MDCIN1/ICSPDAT)
RCT: C?#88.1 R?#84.2 R?#85.2 RJ45#4.4(TD0/P4)
RD+: C?#85.1 RJ45#4.5(RD0+/P5)
RD-: C?#87.1 RJ45#4.6(RD0-/P6)
RST: R?#86.2 U?#12.37(~{RSTN}) U?#13.9(RB2/AN10/CPS10/MDMIN/TX/CK/RX/DT/SDA2/SDI2/SDO1)
RXN: C?#87.2 R?#85.1 U?#12.5(RXN)
RXP: C?#85.2 R?#84.1 U?#12.6(RXP)
SCK: R?#81.2 U?#12.33(SCLK) U?#13.11(RB4/AN8/CPS8/SCL1/SCK1/MDCIN2)
TD+: R?#76.2 RJ45#4.1(TD0+/P1) U?#12.2(TXP)  [also labelled TXP]
TD-: R?#77.2 RJ45#4.3(TD0-/P3) U?#12.1(TXN)  [also labelled TXN]
VCC: C?#74.2 C?#75.2 C?#76.2 C?#77.2 C?#78.2 C?#79.2 C?#80.1 L?#4.2 R?#68.2 R?#70.1 R?#71.1 R?#72.1 R?#76.1 R?#77.1 R?#78.1 U?#10.2(VOUT) U?#12.4(AVDD) U?#12.8(AVDD) U?#12.11(AVDD) U?#12.15(AVDD) U?#12.17(AVDD) U?#12.21(AVDD) U?#12.28(VDD) U?#13.15(VDD_2) U?#13.16(VDD)
VDD: P?#12.5
VSS: P?#12.4
NetBR?#4_1: BR?#4.1(K) C?#67.1 C?#68.1 C?#69.2 D?#10.2 LM7812.1
NetBR?#4_2: BR?#4.2(C) T?#4.3
NetBR?#4_4: BR?#4.4(C) T?#4.4
NetC?#81_2: C?#81.2 R?#69.2 U?#12.31(XO) Y?#4.1
NetC?#82_2: C?#82.2 R?#69.1 U?#12.30(XI) Y?#4.2
NetC?#83_1: C?#83.1 U?#12.20(TOCAP)
NetC?#84_1: C?#84.1 U?#12.22(1V2O)
NetC?#86_1: C?#86.1 R?#78.2 RJ45#4.2(TD0/P2)
NetP?#10_1: P?#10.1 T?#4.2
NetP?#10_2: P?#10.2 T?#4.1
NetR?#70_2: R?#70.2 U?#12.45(PMODE0)
NetR?#71_2: R?#71.2 U?#12.44(PMODE1)
NetR?#72_2: R?#72.2 U?#12.43(PMODE2)
NetR?#73_2: R?#73.2 U?#12.10(EXRES1)
NetR?#74_1: R?#74.1 U?#12.27(ACTLED)
NetR?#75_1: R?#75.1 U?#12.25(LINKLED)

Not connected (* = marked no-connect by the designer): P?#12 1; RJ45#4 7(POE+/P7) 8(POE-/P8); U?#11 5(5B) 6(6B) 7(7B) 10(7C) 11(6C) 12(5C); U?#12 7(DNC) 18(VBG) 23(RSVD1) 24(SPDLED) 26(DUPLED) 38(RSVD2) 39(RSVD3) 40(RSVD4) 41(RSVD5) 42(RSVD6); U?#13 3(RA4/AN4/CPS4/C2OUT/T0CKI/CCP4/SRNQ) 10(RB3/AN9/CPS9/MDOUT/CCP1/P1A/VCAP) 18(RA7/OSC1/CLKIN/P1C/CCP2/P2A)

### Notes on the sheet
- (near U?#12) Pull Down SPI
- (in symbol PIC16F1827-I/SS) PIC16F1827
- (in symbol Regulador 78XX) 78XX; IN; OUT; GND

### Library data of the parts
C?#67 C?#68 C?#70 C?#72 C?#80 = Capacitor Electrolitico
C?#69 C?#71 C?#73-C?#79 C?#81-C?#88 = Capacitor de paso
L?#4 = Inductor: Code_IEC: 1005; Published: 8-Jun-2000; LatestRevisionDate: 29-May-2009; LatestRevisionNote: IPC-7351 Footprint Added.; PackageReference: 0402-A; Publisher: Altium Limited; PackageDescription: Chip Inductor; Code_JEITA: 0402
LM7812 = Regulador 78XX: Voltage Regulator
P?#10 = Header 2: Header, 2-Pin; LatestRevisionDate: 17-Jul-2002; LatestRevisionNote: Re-released for DXP Platform.; Publisher: Altium Limited
P?#11 = Header 4: Header, 4-Pin; LatestRevisionDate: 17-Jul-2002; LatestRevisionNote: Re-released for DXP Platform.; Publisher: Altium Limited
P?#12 = Header 6: Header, 6-Pin; LatestRevisionDate: 17-Jul-2002; LatestRevisionNote: Re-released for DXP Platform.; Publisher: Altium Limited
R?#68-R?#86 = Resistor
RJ45#4 = RJ45Poe
T?#4 = Trans: Transformer; Published: 24-Mar-1999; LatestRevisionDate: 08-Jul-2005; LatestRevisionNote: Mech Layer 1 removed.; PackageReference: TRANS; Publisher: Altium Limited; PackageDescription: Transformer; 4 Leads
U?#10 = REG1117: as U?#1 on sheet Relay; Digi-Key_Purchase_URL: https://www.digikey.com/product-detail/en/texas-instruments/REG1117/REG1117-ND/251211?utm_source=snapeda&utm_medium=aggregator&utm_campaign=symbol; MP: REG1117; Package: SOT-223-4 Texas Instruments; Digi-Key_Part_Number: REG1117-ND; SnapEDA_Link: https://www.snapeda.com/parts/REG1117/Texas%20Instruments/view-part/?ref=snap; Value: *
U?#12 = W5500: as U?#2 on sheet Relay; Package: LQFP-48 Victor Technologies; Price: None; Availability: Unavailable; MP: W5500; SnapEDA_Link: https://www.snapeda.com/parts/W5500/WIZnet/view-part/?ref=snap; Value: *
U?#13 = PIC16F1827-I/SS: as U?#3 on sheet Relay; MP: PIC16F1827-I/SS; Digi-Key_Purchase_URL: https://www.digikey.do/product-detail/en/microchip-technology/PIC16F1827-I-SS/PIC16F1827-I-SS-ND/2201967?utm_source=snapeda&utm_medium=aggregator&utm_campaign=symbol; Package: SSOP-20 Microchip; SnapEDA_Link: https://www.snapeda.com/parts/PIC16F1827-I/SS/Microchip/view-part/?ref=snap; Digi-Key_Part_Number: PIC16F1827-I/SS-ND; Value: *
Y?#4 = ECS-160-20-20A-TR: as Y?#1 on sheet Relay; MP: ECS-160-20-20A-TR; Package: SMD-2 ECS International; Availability: Unavailable; Price: None; SnapEDA_Link: https://www.snapeda.com/parts/ECS-160-20-20A-TR/ECS%20Inc./view-part/?ref=snap; Value: *

## Nets that join several sheets
3.3vD: Relay (5 pins), Switch (5 pins), Keypad (5 pins), Motor_SBS (5 pins)
ActLed: Relay (R?#9.2 RJ45#1.14), Switch (R?#32.2 RJ45#2.14), Keypad (R?#54.2 RJ45#3.14), Motor_SBS (R?#74.2 RJ45#4.14)
CS: Relay (R?#18.2 U?#2.32 U?#3.12), Switch (R?#42.2 U?#5.32 U?#6.12), Keypad (R?#64.2 U?#8.32 U?#9.12), Motor_SBS (R?#82.2 U?#12.32 U?#13.12)
DVC+: Relay (RJ45#1.9), Switch (RJ45#2.9), Keypad (RJ45#3.9), Motor_SBS (RJ45#4.9)
DVC-: Relay (RJ45#1.10), Switch (RJ45#2.10), Keypad (RJ45#3.10), Motor_SBS (RJ45#4.10)
GND: Relay (41 pins), Switch (41 pins), Keypad (38 pins), Motor_SBS (40 pins)
INT: Relay (R?#23.2 U?#2.36 U?#3.7), Switch (R?#46.2 U?#5.36 U?#6.7), Keypad (R?#65.2 U?#8.36 U?#9.7), Motor_SBS (R?#83.2 U?#12.36 U?#13.7)
LED0: Relay (D?#3.1 U?#3.19), Switch (D?#6.1 U?#6.19)
LinkLed: Relay (R?#10.2 RJ45#1.12), Switch (R?#33.2 RJ45#2.12), Keypad (R?#55.2 RJ45#3.12), Motor_SBS (R?#75.2 RJ45#4.12)
MCLK: Relay (P?#3.6 R?#2.1 U?#3.4), Switch (P?#6.6 R?#26.1 U?#6.4), Keypad (P?#9.6 R?#47.1 U?#9.4), Motor_SBS (P?#12.6 R?#68.1 U?#13.4)
MISO: Relay (R?#16.2 U?#2.34 U?#3.8), Switch (R?#39.2 U?#5.34 U?#6.8), Keypad (R?#61.2 U?#8.34 U?#9.8), Motor_SBS (R?#80.2 U?#12.34 U?#13.8)
MOSI: Relay (R?#15.2 U?#2.35 U?#3.17), Switch (R?#38.2 U?#5.35 U?#6.17), Keypad (R?#60.2 U?#8.35 U?#9.17), Motor_SBS (R?#79.2 U?#12.35 U?#13.17)
PGC: Relay (P?#3.2 U?#3.13), Switch (P?#6.2 U?#6.13), Keypad (P?#9.2 U?#9.13), Motor_SBS (P?#12.2 U?#13.13)
PGD: Relay (P?#3.3 U?#3.14), Switch (P?#6.3 U?#6.14), Keypad (P?#9.3 U?#9.14), Motor_SBS (P?#12.3 U?#13.14)
POE+: Relay (D?#4.2 REG?#1.3 RJ45#1.7), Switch (D?#7.2 REG?#2.3 RJ45#2.7), Keypad (D?#9.2 REG?#3.3 RJ45#3.7)
POE-: Relay (RJ45#1.8), Switch (RJ45#2.8), Keypad (RJ45#3.8)
RCT: Relay (C?#22.1 R?#21.2 R?#22.2 RJ45#1.4), Switch (C?#44.1 R?#44.2 R?#45.2 RJ45#2.4), Keypad (C?#66.1 R?#66.2 R?#67.2 RJ45#3.4), Motor_SBS (C?#88.1 R?#84.2 R?#85.2 RJ45#4.4)
RD+: Relay (C?#19.1 RJ45#1.5), Switch (C?#41.1 RJ45#2.5), Keypad (C?#63.1 RJ45#3.5), Motor_SBS (C?#85.1 RJ45#4.5)
RD-: Relay (C?#20.1 RJ45#1.6), Switch (C?#42.1 RJ45#2.6), Keypad (C?#64.1 RJ45#3.6), Motor_SBS (C?#87.1 RJ45#4.6)
RST: Relay (R?#20.2 U?#2.37 U?#3.9), Switch (R?#43.2 U?#5.37 U?#6.9), Motor_SBS (R?#86.2 U?#12.37 U?#13.9)
RXN: Relay (C?#20.2 R?#22.1 U?#2.5), Switch (C?#42.2 R?#45.1 U?#5.5), Keypad (C?#64.2 R?#67.1 U?#8.5), Motor_SBS (C?#87.2 R?#85.1 U?#12.5)
RXP: Relay (C?#19.2 R?#21.1 U?#2.6), Switch (C?#41.2 R?#44.1 U?#5.6), Keypad (C?#63.2 R?#66.1 U?#8.6), Motor_SBS (C?#85.2 R?#84.1 U?#12.6)
SCK: Relay (R?#17.2 U?#2.33 U?#3.11), Switch (R?#40.2 U?#5.33 U?#6.11), Keypad (R?#62.2 U?#8.33 U?#9.11), Motor_SBS (R?#81.2 U?#12.33 U?#13.11)
TD+: Relay (R?#11.2 RJ45#1.1 U?#2.2), Switch (R?#34.2 RJ45#2.1 U?#5.2), Keypad (R?#56.2 RJ45#3.1 U?#8.2), Motor_SBS (R?#76.2 RJ45#4.1 U?#12.2)
TD-: Relay (R?#12.2 RJ45#1.3 U?#2.1), Switch (R?#35.2 RJ45#2.3 U?#5.1), Keypad (R?#57.2 RJ45#3.3 U?#8.1), Motor_SBS (R?#77.2 RJ45#4.3 U?#12.1)
VCC: Relay (31 pins), Switch (32 pins), Keypad (32 pins), Motor_SBS (25 pins)
VDD: Relay (P?#3.5), Switch (P?#6.5), Keypad (P?#9.5), Motor_SBS (P?#12.5)
VSS: Relay (P?#3.4), Switch (P?#6.4), Keypad (P?#9.4), Motor_SBS (P?#12.4)